# Altium schematic sheet Stend_old.SchDoc: Перестраиваемый генератор
size 840 x 594 mm; CheckedBy: Семенцов С. Г.; Author: Наумов И. К.; Address1: Address1; Address2: Address2; Address3: Address3; Address4: Address4; DocumentNumber: ИУ4.11.03.03.24.05.52.15.001 Э1; SheetNumber: 4; SheetTotal: 6; Title2str: прямоугольных импульсов; DocumentType: Схема измерительного стенда; FirstReferrence: ИУ4.11.03.03.24.05.52.15.001
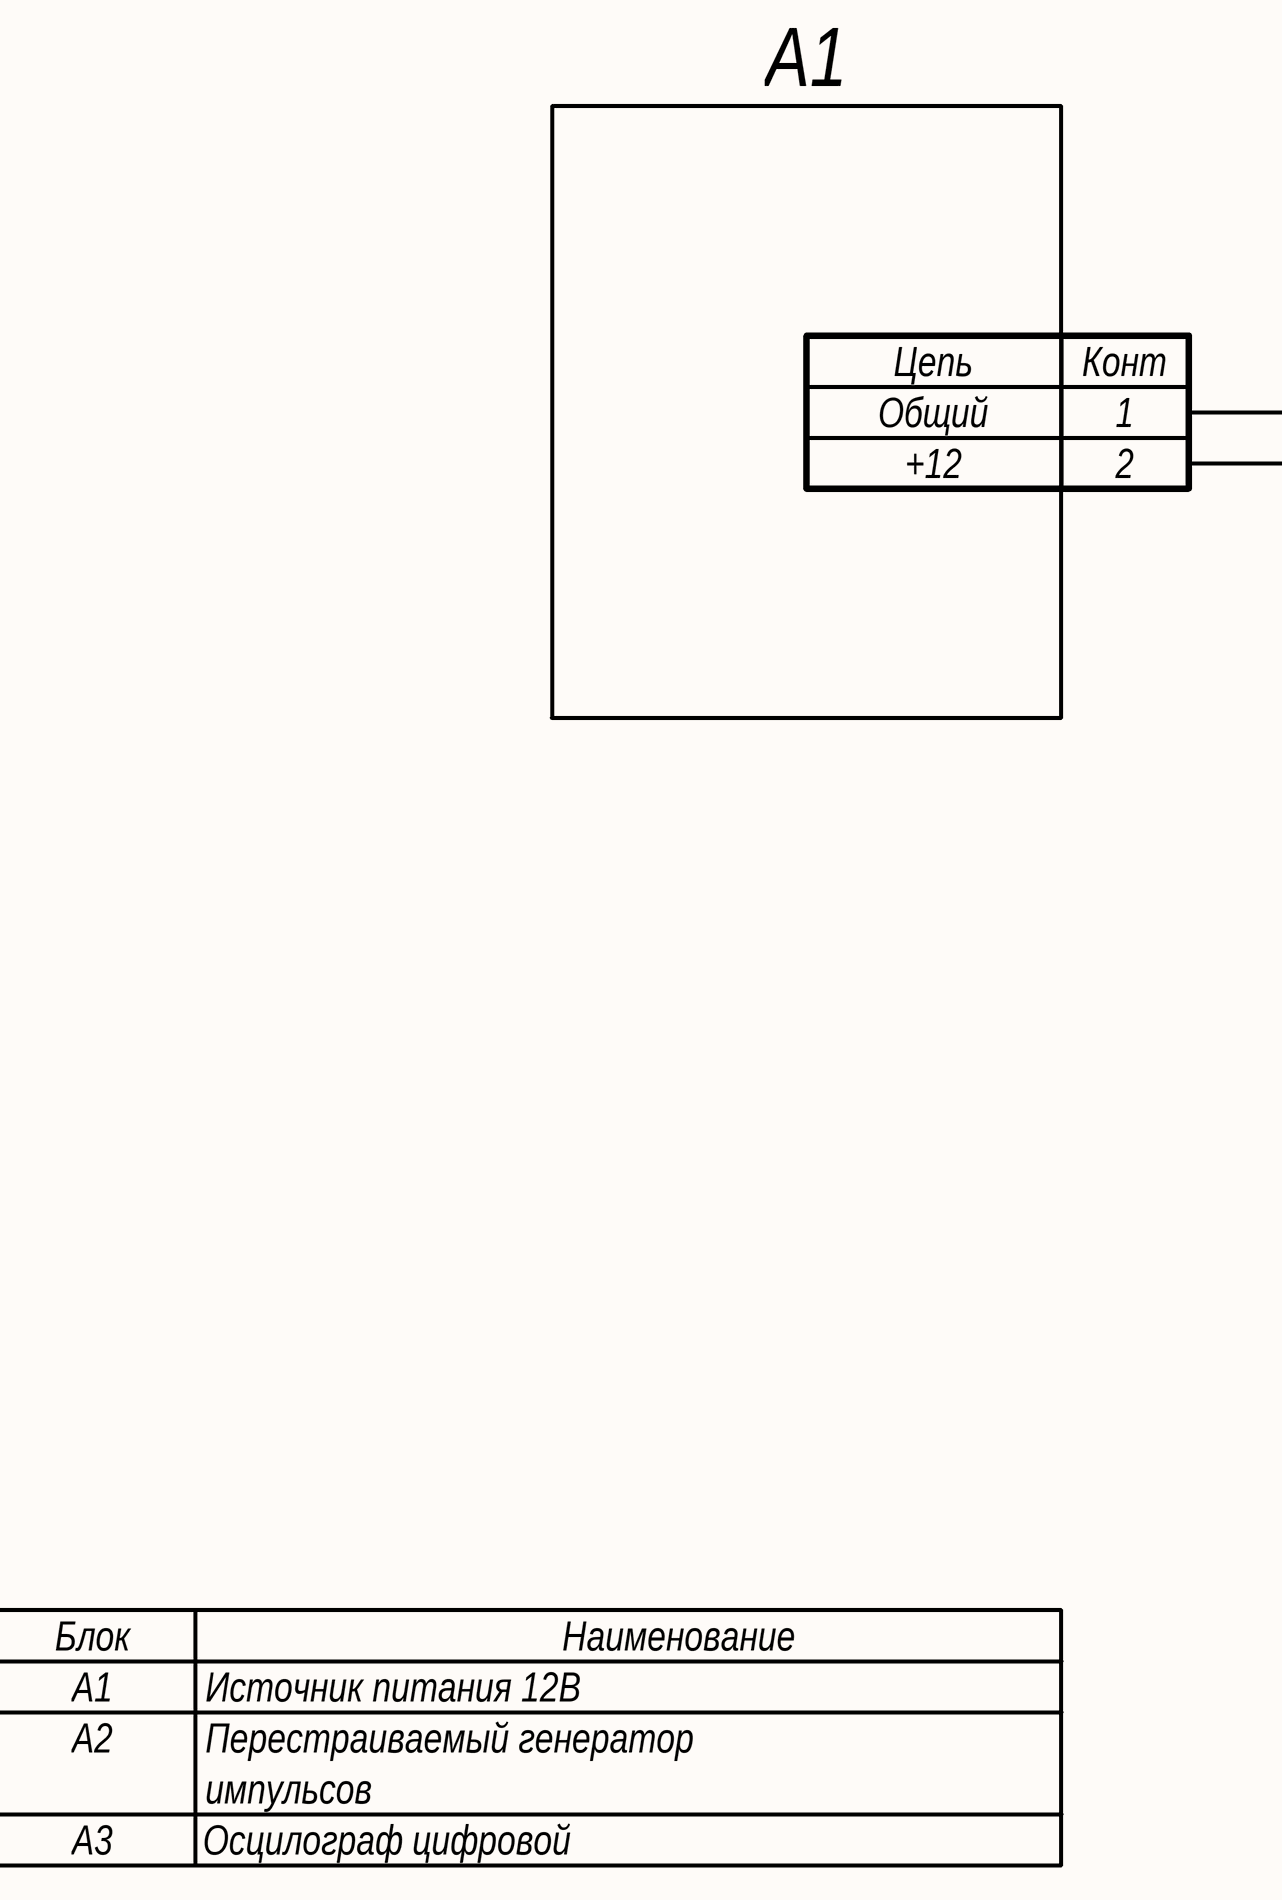
[diagram p0: Stend_old.SchDoc, left]
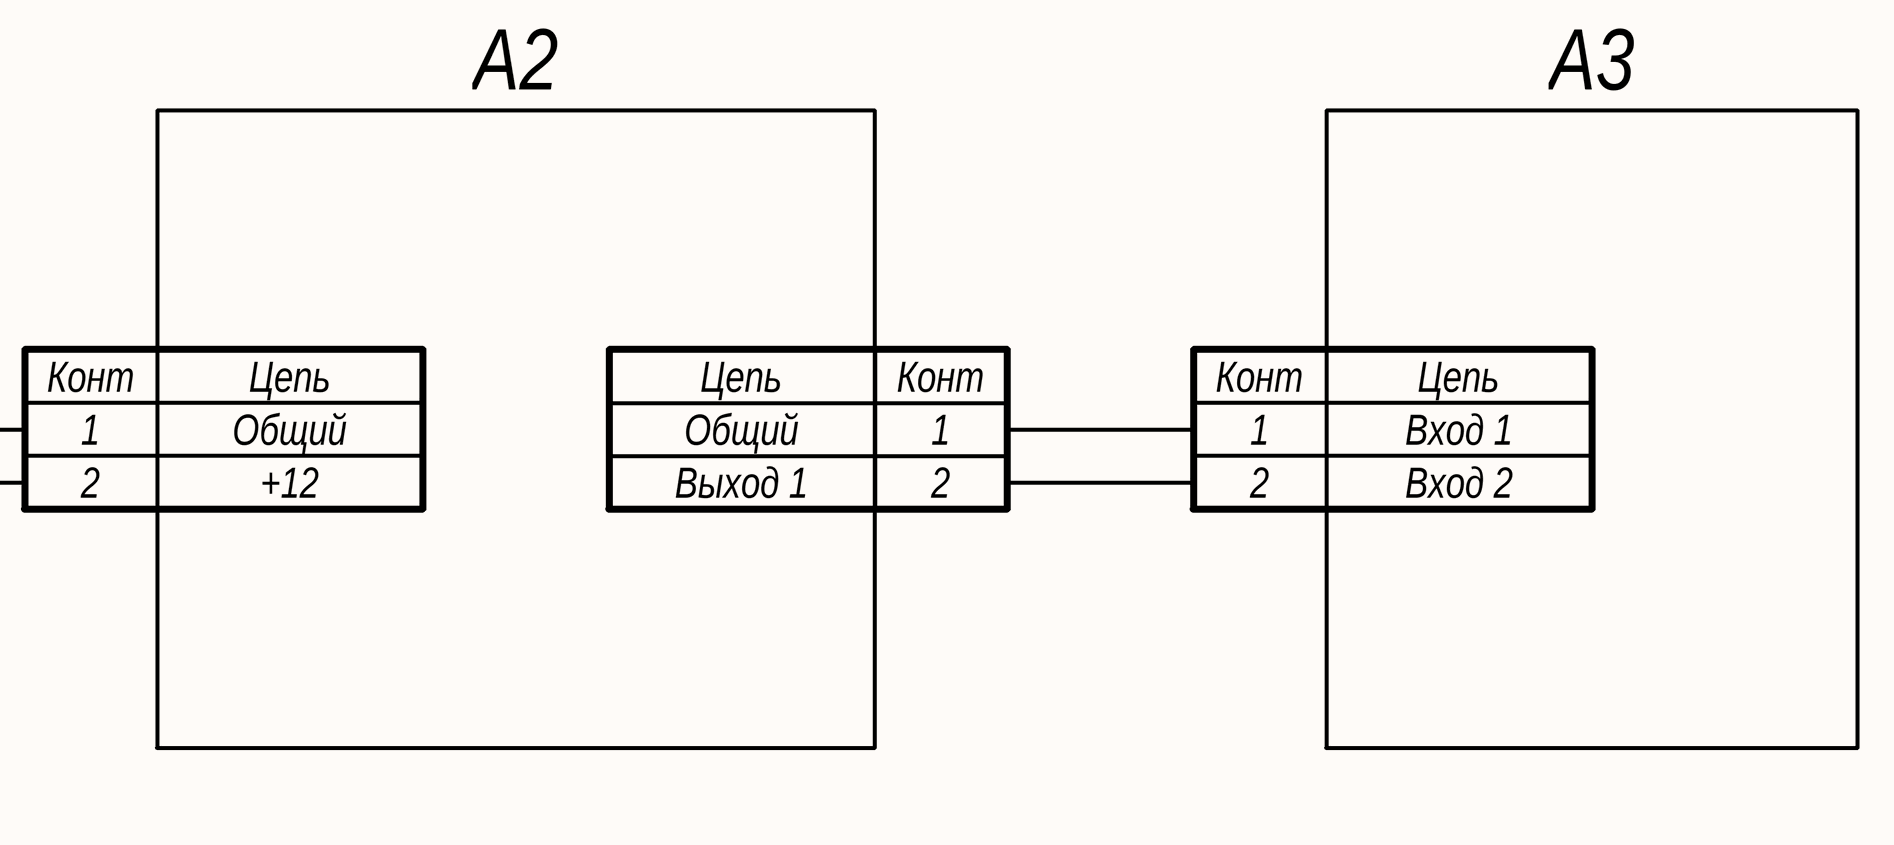
[diagram p1: Stend_old.SchDoc, right]

## Notes on the sheet
- A1
- A2
- A3
- Цепь
- Конт
- Общий
- 1
- Вход 1
- +12
- 2
- Выход 1
- Вход 2
- Блок
- Наименование
- А1
- А2
- Перестраиваемый генератор
- Источник питания 12В
- импульсов
- А3
- Осцилограф цифровой
- Перв. примен.
- Справ. №
- Подп. и дата
- Инв. № дубл.
- Взам. инв. №
- Разраб.
- Изм.
- Лист
- № докум.
- Подп.
- Дата
- Лит.
- Масса
- Масштаб
- Пров.
- Т.контр.
- Листов
- Инв. № подл.
- Утв.
- Н.контр.
- МГТУ им. Н. Э. Баумана
- Кафедра ИУ4
- Группа ИУ4-52Б
- Копировал
- Формат А1